# Altium project PA-15-30W.PrjPcb
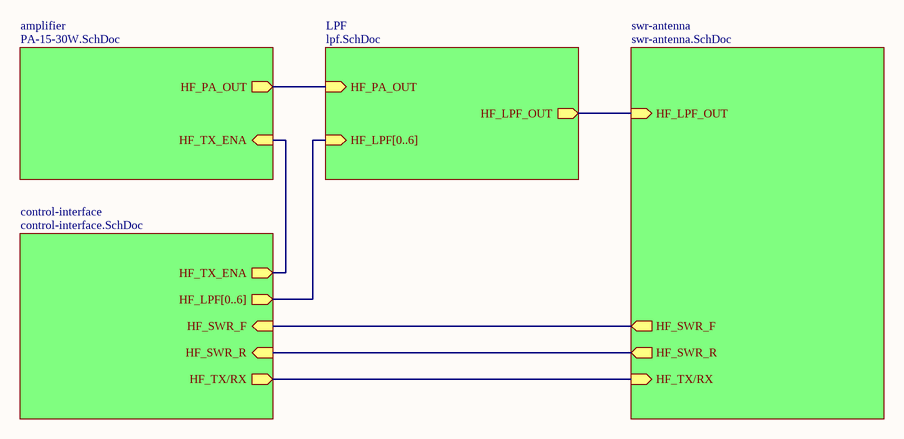
[diagram p0: main.SchDoc]
5 sheets, 172 parts. Net scope: hierarchical (ports join the sheet entries above them; power ports are global).
Board file: PA-15-30W.PcbDoc
Sheets:
  main.SchDoc
    control-interface = control-interface.SchDoc
    amplifier = PA-15-30W.SchDoc
    LPF = lpf.SchDoc
    swr-antenna = swr-antenna.SchDoc

## Sheet main.SchDoc
size A4; SheetNumber: 1; SheetTotal: 5

### Sub-sheets
amplifier = PA-15-30W.SchDoc: HF_PA_OUT (out), HF_TX_ENA (in)
control-interface = control-interface.SchDoc: HF_LPF[0..6] (out), HF_TX_ENA (out), HF_SWR_F (in), HF_SWR_R (in), HF_TX/RX (out)
LPF = lpf.SchDoc: HF_LPF_OUT (out), HF_LPF[0..6] (in), HF_PA_OUT (in)
swr-antenna = swr-antenna.SchDoc: HF_LPF_OUT (in), HF_SWR_F (out), HF_SWR_R (out), HF_TX/RX (in)

### Nets
HF_TX/RX: sheet control-interface/HF_TX/RX, sheet swr-antenna/HF_TX/RX
HF_TX_ENA: sheet control-interface/HF_TX_ENA, sheet amplifier/HF_TX_ENA
NetCON1_12: sheet control-interface/HF_SWR_F, sheet swr-antenna/HF_SWR_F
NetCON1_14: sheet control-interface/HF_SWR_R, sheet swr-antenna/HF_SWR_R
NetK1_9: sheet amplifier/HF_PA_OUT, sheet LPF/HF_PA_OUT
NetK7_4: sheet LPF/HF_LPF_OUT, sheet swr-antenna/HF_LPF_OUT

### Buses and harness runs
bus sheet control-interface/HF_LPF[0..6] = sheet LPF/HF_LPF[0..6]

## Sheet control-interface.SchDoc
size A4; SheetNumber: 4; SheetTotal: 5
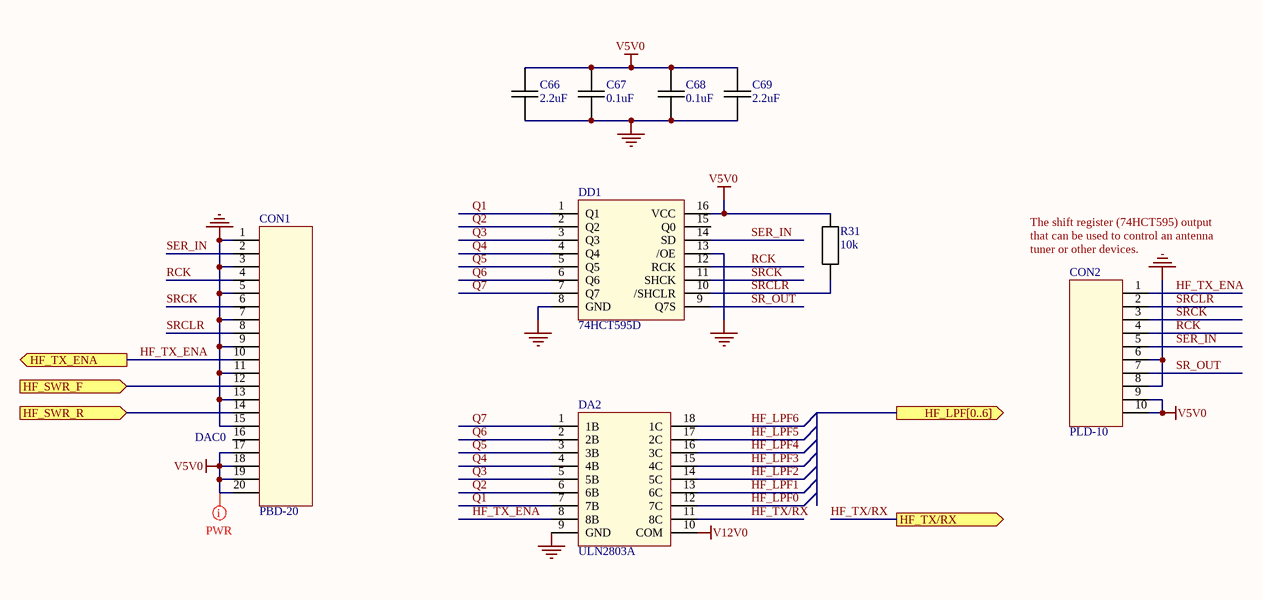
[diagram p1: control-interface.SchDoc]

### Parts
C66  2.2uF  [CAPC2013X100N]
C67  0.1uF  [CAPC2013X100N]
C68  0.1uF  [CAPC2013X100N]
C69  2.2uF  [CAPC2013X100N]
CON1  PBD-20  [PBD-20]
CON2  PLD-10  [PLD-10]
DA2  ULN2803A  [SOIC127P1030X265-18N]
DD1  74HCT595D  [SOIC127P600X175-16N]
R31  10k  [RESC2013X64N]

### Ports
HF_LPF[0..6] (out), HF_SWR_F (in), HF_SWR_R (in), HF_TX/RX (out), HF_TX_ENA (out)

### Nets
GND: C66.1 C67.1 C68.1 C69.1 CON1.1 CON1.3 CON1.5 CON1.7 CON1.9 CON1.11 CON1.13 CON1.15 CON2.6 CON2.8 DA2.9(GND) DD1.8(GND) DD1.13(/OE)
V5V0: C66.2 C67.2 C68.2 C69.2 CON1.17 CON1.18 CON1.19 CON1.20 CON2.9 CON2.10 DD1.16(VCC) R31.2
V12V0: DA2.10(COM)
HF_LPF0: DA2.12(7C)
HF_LPF1: DA2.13(6C)
HF_LPF2: DA2.14(5C)
HF_LPF3: DA2.15(4C)
HF_LPF4: DA2.16(3C)
HF_LPF5: DA2.17(2C)
HF_LPF6: DA2.18(1C)
HF_TX/RX: DA2.11(8C) ; port HF_TX/RX
HF_TX_ENA: CON1.10 CON2.1 DA2.8(8B) ; port HF_TX_ENA
Q1: DA2.7(7B) DD1.1(Q1)
Q2: DA2.6(6B) DD1.2(Q2)
Q3: DA2.5(5B) DD1.3(Q3)
Q4: DA2.4(4B) DD1.4(Q4)
Q5: DA2.3(3B) DD1.5(Q5)
Q6: DA2.2(2B) DD1.6(Q6)
Q7: DA2.1(1B) DD1.7(Q7)
RCK: CON1.4 CON2.4 DD1.12(RCK)
SER_IN: CON1.2 CON2.5 DD1.14(SD)
SR_OUT: CON2.7 DD1.9(Q7S)
SRCK: CON1.6 CON2.3 DD1.11(SHCK)
SRCLR: CON1.8 CON2.2 DD1.10(/SHCLR) R31.1
NetCON1_12: CON1.12 ; port HF_SWR_F
NetCON1_14: CON1.14 ; port HF_SWR_R

Not connected (* = marked no-connect by the designer): CON1 16; DD1 15(Q0)

### Layout directives
net class PowerLines: V5V0

### Notes on the sheet
- (near CON2) The shift register (74HCT595) output that can be used to control an antenna tuner or other devices.
- (near CON1) DAC0

### Library data of the parts
C66-C69 = Cap0805: Capacitor 2x1.25 mm
CON1 = CONNECTOR-20
CON2 = CONNECTOR-10
DA2 = ULN2803A: Darlington Transistor Array
DD1 = 74HCT595D: 8-bit serial-in, serial or parallel-out shift register with output / latches; 3-state, / imrad
R31 = Res0805

## Sheet PA-15-30W.SchDoc
size A4; SheetNumber: 3; SheetTotal: 5
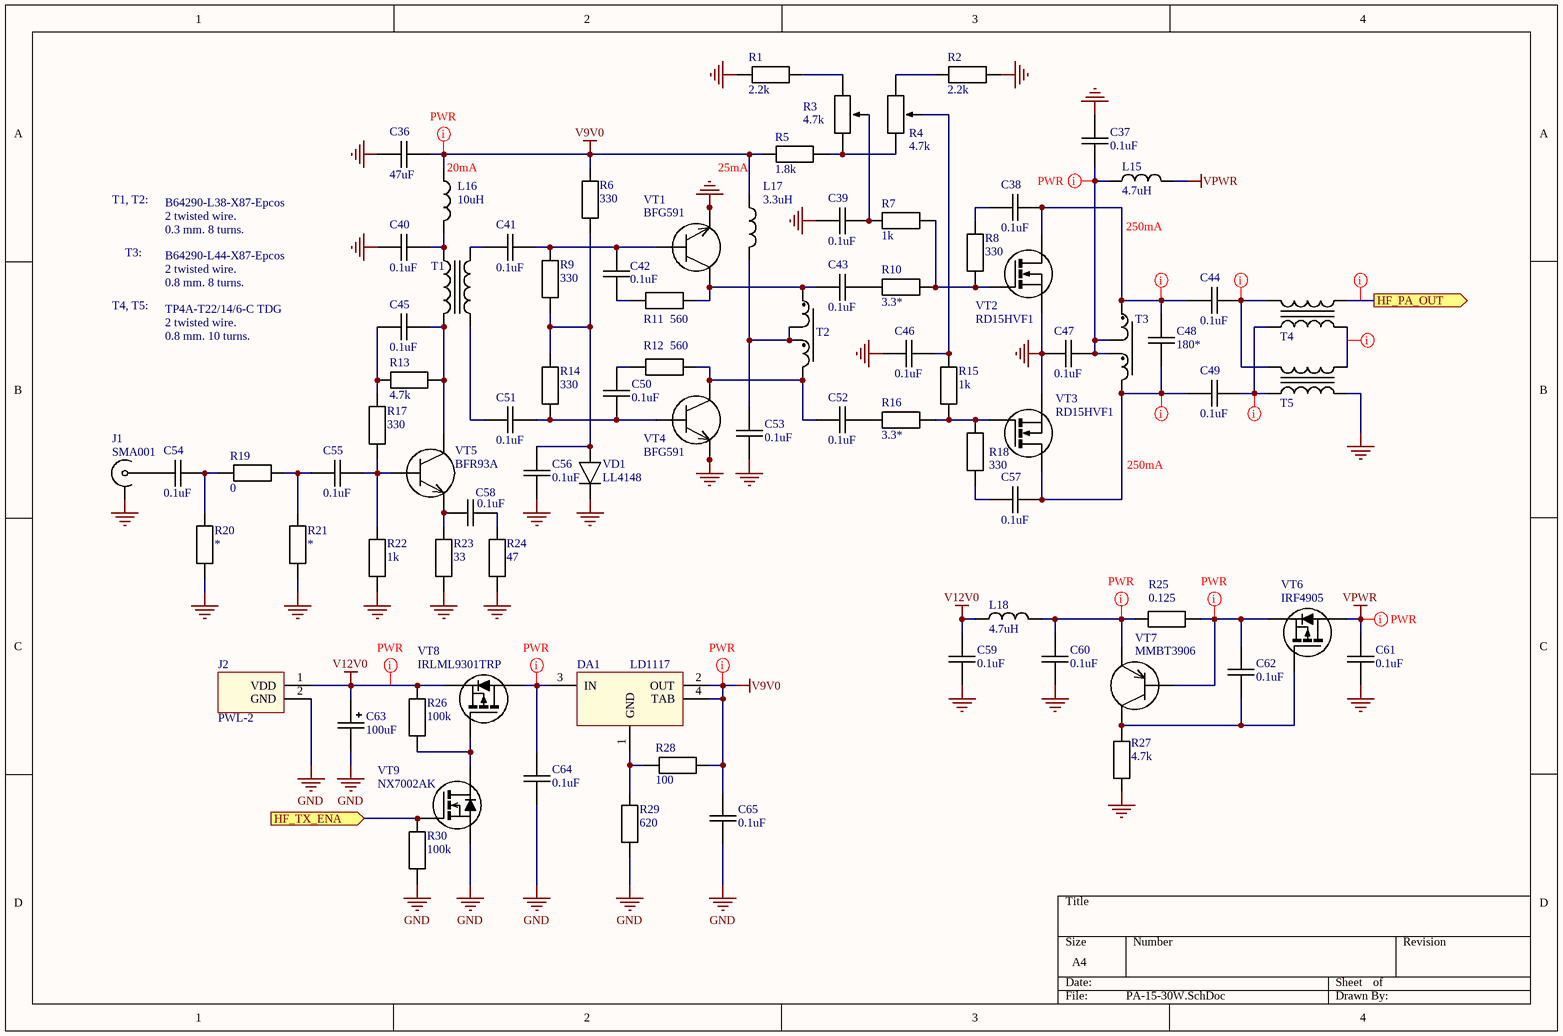
[diagram p2: PA-15-30W.SchDoc]

### Parts
C36  47uF  [CAPC3225X270N]
C37  0.1uF  [CAPC3216X125N]
C38  0.1uF  [CAPC2013X100N]
C39  0.1uF  [CAPC2013X100N]
C40  0.1uF  [CAPC2013X100N]
C41  0.1uF  [CAPC2013X100N]
C42  0.1uF  [CAPC2013X100N]
C43  0.1uF  [CAPC2013X100N]
C44  0.1uF  [CAPC4532X218N]
C45  0.1uF  [CAPC2013X100N]
C46  0.1uF  [CAPC2013X100N]
C47  0.1uF  [CAPC3216X125N]
C48  180*  [CAPC3216X125N]
C49  0.1uF  [CAPC4532X218N]
C50  0.1uF  [CAPC2013X100N]
C51  0.1uF  [CAPC2013X100N]
C52  0.1uF  [CAPC2013X100N]
C53  0.1uF  [CAPC2013X100N]
C54  0.1uF  [CAPC2013X100N]
C55  0.1uF  [CAPC2013X100N]
C56  0.1uF  [CAPC2013X100N]
C57  0.1uF  [CAPC2013X100N]
C58  0.1uF  [CAPC2013X100N]
C59  0.1uF  [CAPC2013X100N]
C60  0.1uF  [CAPC2013X100N]
C61  0.1uF  [CAPC2013X100N]
C62  0.1uF  [CAPC2013X100N]
C63  100uF  [CAPPR500-1050X1300]
C64  0.1uF  [CAPC2013X100N]
C65  0.1uF  [CAPC2013X100N]
DA1  LD1117  [SOT230P700X180-4N]
J1  SMA001  [SMA002]
J2  PWL-2  [PWL-2]
L15  4.7uH  [Inductor radial]
L16  10uH  [RESC2013X64N]
L17  3.3uH  [RES1270-650X250]
L18  4.7uH  [Inductor radial]
R1  2.2k  [RESC2013X64N]
R2  2.2k  [RESC2013X64N]
R3  4.7k  [3296W]
R4  4.7k  [3296W]
R5  1.8k  [RESC2013X64N]
R6  330  [RESC2013X64N]
R7  1k  [RESC2013X64N]
R8  330  [RESC2013X64N]
R9  330  [RESC2013X64N]
R10  3.3*  [RESC2013X64N]
R11  560  [RESC2013X64N]
R12  560  [RESC2013X64N]
R13  4.7k  [RESC2013X64N]
R14  330  [RESC2013X64N]
R15  1k  [RESC2013X64N]
R16  3.3*  [RESC2013X64N]
R17  330  [RESC2013X64N]
R18  330  [RESC2013X64N]
R19  0  [RESC2013X64N]
R20  *  [RESC2013X64N]
R21  *  [RESC2013X64N]
R22  1k  [RESC2013X64N]
R23  33  [RESC2013X64N]
R24  47  [RESC2013X64N]
R25  0.125  [RESC3216X80N]
R26  100k  [RESC2013X64N]
R27  4.7k  [RESC2013X64N]
R28  100  [RESC2013X64N]
R29  620  [RESC2013X64N]
R30  100k  [RESC2013X64N]
T1  R10*6*4 N87  [R10x6x4]  (value not drawn)
T2  R10*6*4 N87  [R10x6x4]  (value not drawn)
T3  R12,5*7,5*5 N87  [R12.5x7.5x5]  (value not drawn)
T4  TP4A-T22/14/6-C TDG  [R22x14x6]  (value not drawn)
T5  TP4A-T22/14/6-C TDG  [R22x14x6]  (value not drawn)
VD1  LL4148  [DIOMELF3515N]
VT1  BFG591  [SOT230P700X180-4N]
VT2  RD15HVF1  [TO-220-HFLIP]
VT3  RD15HVF1  [TO-220-HFLIP]
VT4  BFG591  [SOT230P700X180-4N]
VT5  BFR93A  [SOT95P229X119-3N]
VT6  IRF4905  [TO-220-v]
VT7  MMBT3906  [SOT95P229X119-3N]
VT8  IRLML9301TRP  [SOT95P229X119-3N]
VT9  NX7002AK  [SOT95P229X119-3N]

### Ports
HF_PA_OUT (out), HF_TX_ENA (in)

### Nets
GND: C36.1 C37.2 C39.2 C40.2 C46.1 C47.1 C53.2 C56.2 C59.2 C60.2 C61.2 C63.2 C64.1 C65.1 J1.2(GND) J2.2(GND) R1.1 R2.1 R20.1 R21.1 R22.1 R23.1 R24.1 R27.2 R29.1 R30.1 T5.3 VD1.1(C) VT1.1(E) VT1.3(E) VT2.2(S) VT3.2(S) VT4.1(E) VT4.3(E) VT9.2(S)
V9V0: C36.2 C65.2 DA1.2(OUT) DA1.4(TAB) L16.2 L17.2 R5.2 R6.2 R28.2
V12V0: C59.1 C63.1 J2.1(VDD) L18.1 R26.2 VT8.2(S)
VPWR: C61.1 L15.2 VT6.2(D)
HF_TX_ENA: R30.2 VT9.1(G) ; port HF_TX_ENA
NetC37_1: C37.1 C47.2 L15.1 T3.2 T3.4
NetC38_1: C38.1 C44.1 C48.2 T3.3 VT2.3(D)
NetC38_2: C38.2 R8.2
NetC39_1: C39.1 R3.2 R7.2
NetC40_1: C40.1 L16.1 T1.1
NetC41_1: C41.1 C42.2 R9.2 VT1.2(B)
NetC41_2: C41.2 T1.2
NetC42_1: C42.1 R11.1
NetC43_1: C43.1 R10.2
NetC43_2: C43.2 R11.2 T2.3 VT1.4(C)
NetC44_2: C44.2 T4.1 T5.1
NetC45_1: C45.1 R13.1 T1.4 VT5.3(C)
NetC45_2: C45.2 R13.2 R17.2
NetC46_2: C46.2 R4.2 R15.2
NetC48_1: C48.1 C49.1 C57.1 T3.1 VT3.3(D)
NetC49_2: C49.2 T4.2 T5.2
NetC50_1: C50.1 C51.1 R14.1 VT4.2(B)
NetC50_2: C50.2 R12.1
NetC51_2: C51.2 T1.3
NetC52_1: C52.1 R16.2
NetC52_2: C52.2 R12.2 T2.1 VT4.4(C)
NetC53_1: C53.1 L17.1 T2.2 T2.4
NetC54_1: C54.1 J1.1(RF)
NetC54_2: C54.2 R19.1 R20.2
NetC55_1: C55.1 R19.2 R21.2
NetC55_2: C55.2 R17.1 R22.2 VT5.1(B)
NetC56_1: C56.1 R6.1 R9.1 R14.2 VD1.2(A)
NetC57_2: C57.2 R18.1
NetC58_1: C58.1 R24.2
NetC58_2: C58.2 R23.2 VT5.2(E)
NetC60_1: C60.1 L18.2 R25.2 VT7.2(E)
NetC62_1: C62.1 R25.1 VT6.3(S) VT7.1(B)
NetC62_2: C62.2 R27.1 VT6.1(G) VT7.3(C)
NetC64_2: C64.2 DA1.3(IN) VT8.3(D)
NetDA1_1: DA1.1(GND) R28.1 R29.2
NetK1_9: T4.4 ; port HF_PA_OUT
NetR1_2: R1.2 R3.3
NetR2_2: R2.2 R4.3
NetR3_1: R3.1 R4.1 R5.1
NetR7_1: R7.1 R8.1 R10.1 VT2.1(G)
NetR15_1: R15.1 R16.1 R18.2 VT3.1(G)
NetR26_1: R26.1 VT8.1(G) VT9.3(D)
NetT4_3: T4.3 T5.4

### Layout directives
net class OutPowerNet: NetC38_1, NetC44_2, NetC48_1, NetC49_2, NetK1_9, NetT4_3
net class PowerLines: NetC37_1, NetC60_1, NetC62_1, NetC64_2, V9V0, V12V0, VPWR

### Notes on the sheet
- (near L16) 20mA
- 25mA
- T1, T2:
- В64290-L38-Х87-Epcos
  2 twisted wire.
  0.3 mm. 8 turns.
- (near L15) 250mA
- T4, T5:
- T3:
- B64290-L44-X87-Epcos
  2 twisted wire.
  0.8 mm. 8 turns.
- TP4A-T22/14/6-C TDG
  2 twisted wire.
  0.8 mm. 10 turns.
- 250mA

### Library data of the parts
C36 = Cap1210: GRM32ER71A476KE15L
C37 = Cap1206: FM31X104K251EEG
C38-C43 C45 C46 C50-C62 C64 C65 = Cap0805: Capacitor 2x1.25 mm
C44 C49 = Cap1812: GRM43DR72J104KW01 (1812, X7R:EIA, 0.1uF, DC630V), rcs
C47 = Cap1206: FM31X104K251EEG, rcs
C48 = Cap1206: 1206, NP0, 1kV
C63 = CapPolarized: EEUFR1E471, imrad
DA1 = LD1117: Adjustable and fixed low drop positive voltage regulator
J1 = RF Connector
J2 = PWR_CONNECTOR
L15 L18 = Inductor: Bochen, 4.7µH±10%, Idc=5.0А, Rdc мax=0.05
L16 = Inductor: SMD 0805 50-100mA / LQM21FN100M70L, Imrad
L17 = Inductor: 3,3uH ±10% аксиальный дроссель 670mA 0,34Ohm (KLS18-EC36-3R3K-A – KLS)
R1 R2 R5-R24 R26-R30 = Res0805
R3 = potentiometer: 4,7 kOhm 3296W (KLS4-3296W-472), rcs
R4 = potentiometer
R25 = Res0805: 8 items 1 Om in paralel,1206
T1 = transformer type 2: R10*6*4 N87 (В64290-L38-Х87-Epcos)
T2 = transformer type 1: R10*6*4 N87 (В64290-L38-Х87-Epcos); pin to pad: 1>4 2>3 3>2 4>1
T3 = transformer type 1: R12,5*7,5*5 N87 (B64290-L44-X87-Epcos)
T4 T5 = transformer type 2
VD1 = DIODE
VT1 VT4 = BFG591: NPN 7 GHz wideband transistor
VT5 = BFR93A: NPN 6 GHz wideband transistor
VT6 = IRF4905: HEXFET® Power MOSFET
VT7 = MMBT3906: MMBT3906LT1G, PNP General Purpose Amplifier / imrad
VT9 = N-MOSFET 1G 2S 3D

## Sheet lpf.SchDoc
size A4; SheetNumber: 2; SheetTotal: 5
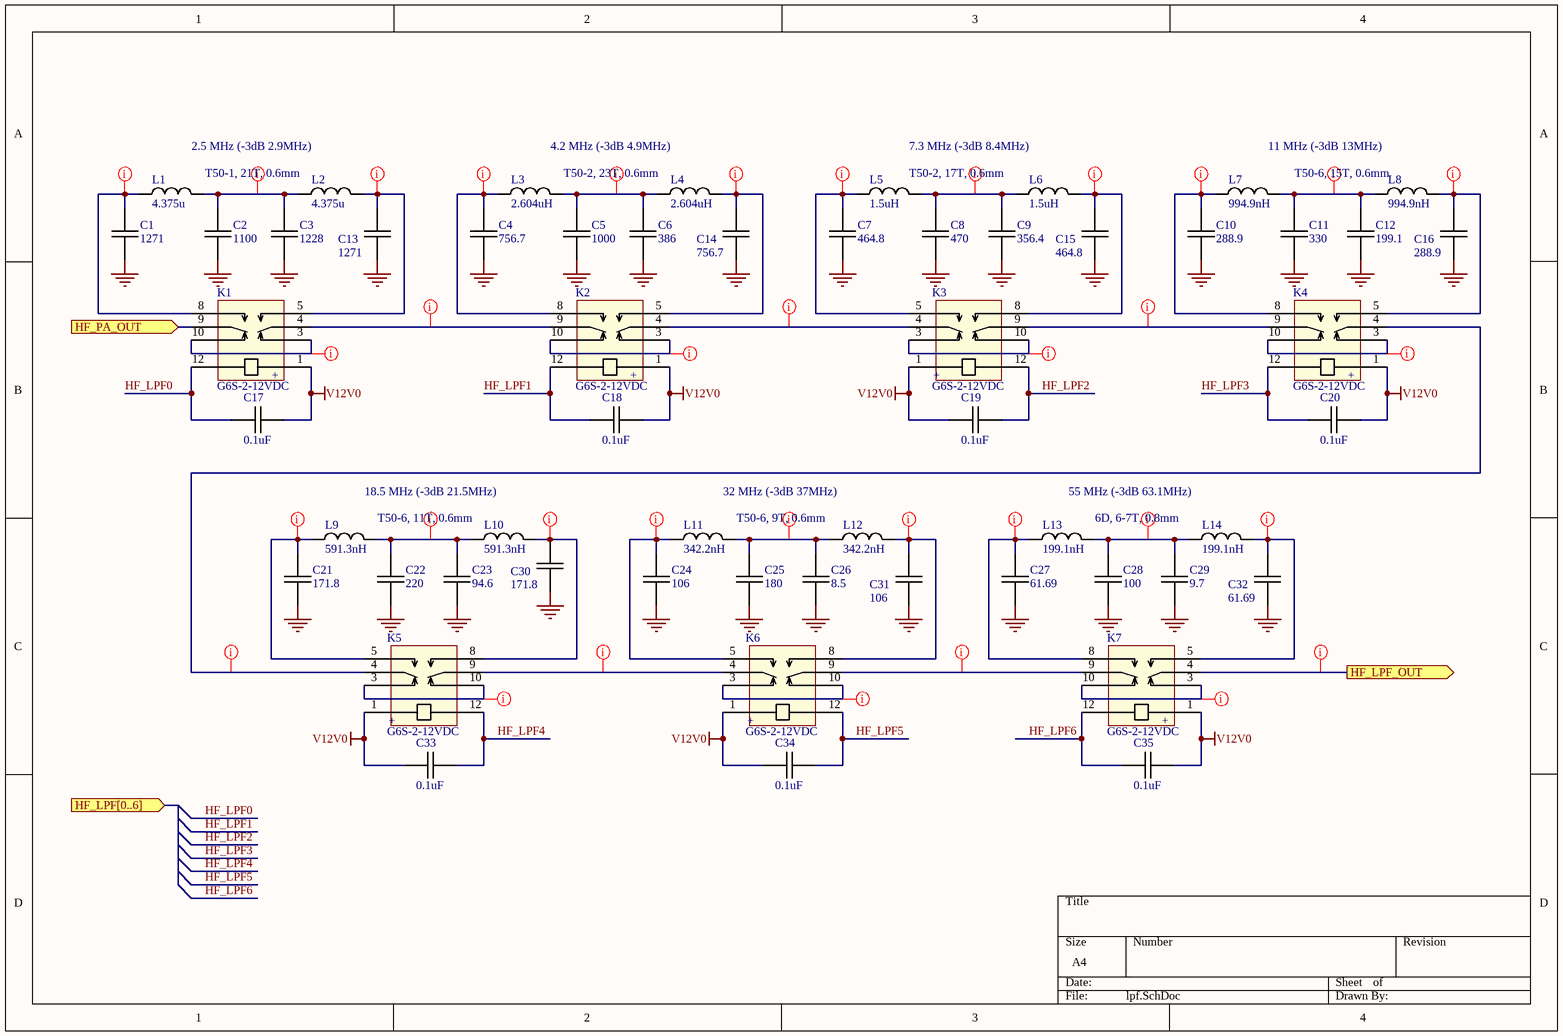
[diagram p3: lpf.SchDoc]

### Parts
C1  1271  [CAPC3216X125N]
C2  1100  [CAPC3216X125N]
C3  1228  [CAPC3216X125N]
C4  756.7  [CAPC3216X125N]
C5  1000  [CAPC3216X125N]
C6  386  [CAPC3216X125N]
C7  464.8  [CAPC3216X125N]
C8  470  [CAPC3216X125N]
C9  356.4  [CAPC3216X125N]
C10  288.9  [CAPC3216X125N]
C11  330  [CAPC3216X125N]
C12  199.1  [CAPC3216X125N]
C13  1271  [CAPC3216X125N]
C14  756.7  [CAPC3216X125N]
C15  464.8  [CAPC3216X125N]
C16  288.9  [CAPC3216X125N]
C17  0.1uF  [CAPC2013X100N]
C18  0.1uF  [CAPC2013X100N]
C19  0.1uF  [CAPC2013X100N]
C20  0.1uF  [CAPC2013X100N]
C21  171.8  [CAPC3216X125N]
C22  220  [CAPC3216X125N]
C23  94.6  [CAPC3216X125N]
C24  106  [CAPC3216X125N]
C25  180  [CAPC3216X125N]
C26  8.5  [CAPC3216X125N]
C27  61.69  [CAPC3216X125N]
C28  100  [CAPC3216X125N]
C29  9.7  [CAPC3216X125N]
C30  171.8  [CAPC3216X125N]
C31  106  [CAPC3216X125N]
C32  61.69  [CAPC3216X125N]
C33  0.1uF  [CAPC2013X100N]
C34  0.1uF  [CAPC2013X100N]
C35  0.1uF  [CAPC2013X100N]
K1  G6S-2-12VDC  [G6S-2]
K2  G6S-2-12VDC  [G6S-2]
K3  G6S-2-12VDC  [G6S-2]
K4  G6S-2-12VDC  [G6S-2]
K5  G6S-2-12VDC  [G6S-2]
K6  G6S-2-12VDC  [G6S-2]
K7  G6S-2-12VDC  [G6S-2]
L1  4.375u  [T50-2]
L2  4.375u  [T50-2]
L3  2.604uH  [T50-2]
L4  2.604uH  [T50-2]
L5  1.5uH  [T50-6]
L6  1.5uH  [T50-6]
L7  994.9nH  [T50-6]
L8  994.9nH  [T50-6]
L9  591.3nH  [T50-6]
L10  591.3nH  [T50-6]
L11  342.2nH  [T50-6]
L12  342.2nH  [T50-6]
L13  199.1nH  [T50-6]
L14  199.1nH  [T50-6]

### Ports
HF_LPF[0..6] (in), HF_LPF_OUT (out), HF_PA_OUT (in)

### Nets
GND: C1.1 C2.1 C3.1 C4.1 C5.1 C6.1 C7.1 C8.1 C9.1 C10.1 C11.1 C12.1 C13.1 C14.1 C15.1 C16.1 C21.1 C22.1 C23.1 C24.1 C25.1 C26.1 C27.1 C28.1 C29.1 C30.1 C31.1 C32.1
V12V0: C17.1 C18.1 C19.2 C20.1 C33.2 C34.2 C35.1 K1.1 K2.1 K3.1 K4.1 K5.1 K6.1 K7.1
HF_LPF0: C17.2 K1.12
HF_LPF1: C18.2 K2.12
HF_LPF2: C19.1 K3.12
HF_LPF3: C20.2 K4.12
HF_LPF4: C33.1 K5.12
HF_LPF5: C34.1 K6.12
HF_LPF6: C35.2 K7.12
NetC1_2: C1.2 K1.8 L1.1
NetC2_2: C2.2 C3.2 L1.2 L2.1
NetC4_2: C4.2 K2.8 L3.1
NetC5_2: C5.2 C6.2 L3.2 L4.1
NetC7_2: C7.2 K3.5 L5.1
NetC8_2: C8.2 C9.2 L5.2 L6.1
NetC10_2: C10.2 K4.8 L7.1
NetC11_2: C11.2 C12.2 L7.2 L8.1
NetC13_2: C13.2 K1.5 L2.2
NetC14_2: C14.2 K2.5 L4.2
NetC15_2: C15.2 K3.8 L6.2
NetC16_2: C16.2 K4.5 L8.2
NetC21_2: C21.2 K5.5 L9.1
NetC22_2: C22.2 C23.2 L9.2 L10.1
NetC24_2: C24.2 K6.5 L11.1
NetC25_2: C25.2 C26.2 L11.2 L12.1
NetC27_2: C27.2 K7.8 L13.1
NetC28_2: C28.2 C29.2 L13.2 L14.1
NetC30_2: C30.2 K5.8 L10.2
NetC31_2: C31.2 K6.8 L12.2
NetC32_2: C32.2 K7.5 L14.2
NetK1_3: K1.3 K1.10
NetK1_4: K1.4 K2.9
NetK1_9: K1.9 ; port HF_PA_OUT
NetK2_3: K2.3 K2.10
NetK2_4: K2.4 K3.4
NetK3_3: K3.3 K3.10
NetK3_9: K3.9 K4.9
NetK4_3: K4.3 K4.10
NetK4_4: K4.4 K5.4
NetK5_3: K5.3 K5.10
NetK5_9: K5.9 K6.4
NetK6_3: K6.3 K6.10
NetK6_9: K6.9 K7.9
NetK7_3: K7.3 K7.10
NetK7_4: K7.4 ; port HF_LPF_OUT

### Layout directives
net class OutPowerNet: NetC1_2, NetC2_2, NetC4_2, NetC5_2, NetC7_2, NetC8_2, NetC10_2, NetC11_2, NetC13_2, NetC14_2, NetC15_2, NetC16_2, NetC21_2, NetC22_2, NetC24_2, NetC25_2, NetC27_2, NetC28_2, NetC30_2, NetC31_2, NetC32_2, NetK1_3, NetK1_4, NetK2_3, NetK2_4, NetK3_3, NetK3_9, NetK4_3, NetK4_4, NetK5_3, NetK5_9, NetK6_3, NetK6_9, NetK7_3, NetK7_4

### Notes on the sheet
- 2.5 MHz (-3dB 2.9MHz)
- T50-1, 21T, 0.6mm
- 4.2 MHz (-3dB 4.9MHz)
- T50-2, 23T, 0.6mm
- 7.3 MHz (-3dB 8.4MHz)
- T50-2, 17T, 0.6mm
- 11 MHz (-3dB 13MHz)
- (near L8) T50-6, 15T, 0.6mm
- 18.5 MHz (-3dB 21.5MHz)
- 32 MHz (-3dB 37MHz)
- 55 MHz (-3dB 63.1MHz)
- T50-6, 11T, 0.6mm
- T50-6, 9T, 0.6mm
- 6D, 6-7T, 0.8mm
- (in symbol G6S-2-12VDC) +

### Library data of the parts
C1-C16 C21-C32 = Cap1206: 1206, NP0, 1kV
C17-C20 C33-C35 = Cap0805: Capacitor 2x1.25 mm
K1-K7 = G6S-2-12VDC: Compact, Industry-Standard 2-pole relay
L1 L2 = Inductor: T50-1
L3-L6 = Inductor: T50-2
L7-L14 = Inductor: T50-6

## Sheet swr-antenna.SchDoc
size A4; SheetNumber: 5; SheetTotal: 5
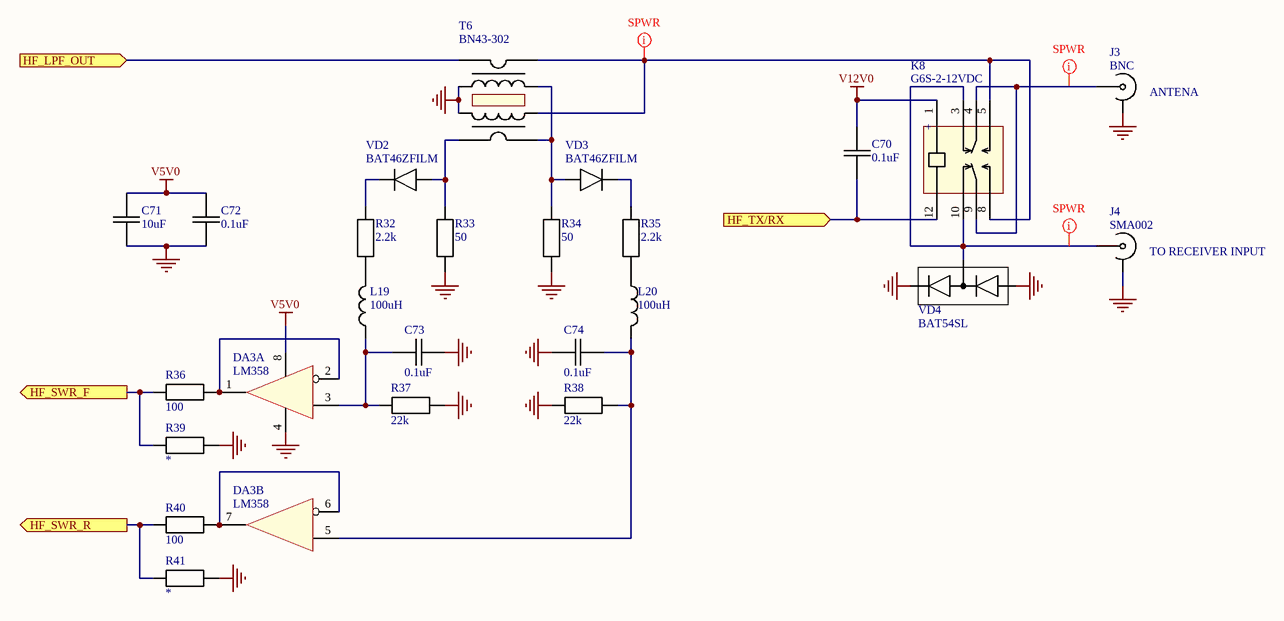
[diagram p4: swr-antenna.SchDoc]

### Parts
C70  0.1uF  [CAPC2013X100N]
C71  10uF  [CAPC2013X100N]
C72  0.1uF  [CAPC2013X100N]
C73  0.1uF  [CAPC2013X100N]
C74  0.1uF  [CAPC2013X100N]
DA3  LM358  [SOIC127P600X175-8N]  (parts A,B of 2)
J3  BNC  [BNC-TYCO_1-1337542-0]
J4  SMA002  [SMA002]
K8  G6S-2-12VDC  [G6S-2]
L19  100uH  [INDUCTOR-1008]
L20  100uH  [INDUCTOR-1008]
R32  2.2k  [RESC2013X64N]
R33  50  [RESC2013X64N]
R34  50  [RESC2013X64N]
R35  2.2k  [RESC2013X64N]
R36  100  [RESC2013X64N]
R37  22k  [RESC2013X64N]
R38  22k  [RESC2013X64N]
R39  *  [RESC2013X64N]
R40  100  [RESC2013X64N]
R41  *  [RESC2013X64N]
T6  BN43-302  [TANDEM]
VD2  BAT46ZFILM  [SOD3816X118N]
VD3  BAT46ZFILM  [SOD3816X118N]
VD4  BAT54SL  [SOT95P229X119-3N]

### Ports
HF_LPF_OUT (in), HF_SWR_F (out), HF_SWR_R (out), HF_TX/RX (in)

### Nets
GND: C71.1 C72.1 C73.2 C74.1 DA3.4(GND) J3.2(GND) J4.2(GND) R33.1 R34.1 R37.1 R38.2 R39.1 R41.1 T6.3 T6.5 VD4.1(A) VD4.2(C)
V5V0: C71.2 C72.2 DA3.8(VCC)
V12V0: C70.2 K8.1
HF_TX/RX: C70.1 K8.12 ; port HF_TX/RX
NetC73_1: C73.1 DA3.3(IN1+) L19.1 R37.2
NetC74_2: C74.2 DA3.5(IN2+) L20.2 R38.1
NetCON1_12: R36.2 R39.2 ; port HF_SWR_F
NetCON1_14: R40.2 R41.2 ; port HF_SWR_R
NetDA3_1: DA3.1(OUT1) DA3.2(IN1-) R36.1
NetDA3_6: DA3.6(IN2-) DA3.7(OUT2) R40.1
NetJ3_1: J3.1(RF) K8.4 K8.9
NetJ4_1: J4.1(RF) K8.3 K8.10 VD4.3(AC)
NetK7_4: T6.1 ; port HF_LPF_OUT
NetK8_5: K8.5 K8.8 T6.2 T6.6
NetL19_2: L19.2 R32.1
NetL20_1: L20.1 R35.1
NetR32_2: R32.2 VD2.1(C)
NetR33_2: R33.2 T6.7 VD2.2(A)
NetR34_2: R34.2 T6.4 T6.8 VD3.2(A)
NetR35_2: R35.2 VD3.1(C)

### Layout directives
net class OutPowerNet: NetJ3_1, NetJ4_1, NetK8_5

### Notes on the sheet
- (near J3) ANTENA
- (near J4) TO RECEIVER INPUT
- (in symbol G6S-2-12VDC) +

### Library data of the parts
C70-C74 = Cap0805: Capacitor 2x1.25 mm
DA3 = LM358: Single Supply Dual / Operational Amplifiers
J3 = RF Connector: EM-BC028M-NGP-50
J4 = RF Connector
K8 = G6S-2-12VDC: Compact, Industry-Standard 2-pole relay
L19 L20 = Inductor: SWI1008HT101K-Hitano
R32-R41 = Res0805
T6 = tandem match
VD2 VD3 = DIODE: Small signal Schottky diodes / imrad; pin to pad: 1>2
VD4 = DIODE-2-1A-3C-3A-2C

## Nets that join several sheets
GND: control-interface (17 pins), PA-15-30W (35 pins), lpf (28 pins), swr-antenna (17 pins)
V5V0: control-interface (12 pins), swr-antenna (C71.2 C72.2 DA3.8)
V12V0: control-interface (DA2.10), PA-15-30W (6 pins), lpf (14 pins), swr-antenna (C70.2 K8.1)
HF_TX/RX: control-interface (DA2.11), swr-antenna (C70.1 K8.12)
HF_TX_ENA: control-interface (CON1.10 CON2.1 DA2.8), PA-15-30W (R30.2 VT9.1)
NetCON1_12: control-interface (CON1.12), swr-antenna (R36.2 R39.2)
NetCON1_14: control-interface (CON1.14), swr-antenna (R40.2 R41.2)
NetK1_9: PA-15-30W (T4.4), lpf (K1.9)
NetK7_4: lpf (K7.4), swr-antenna (T6.1)